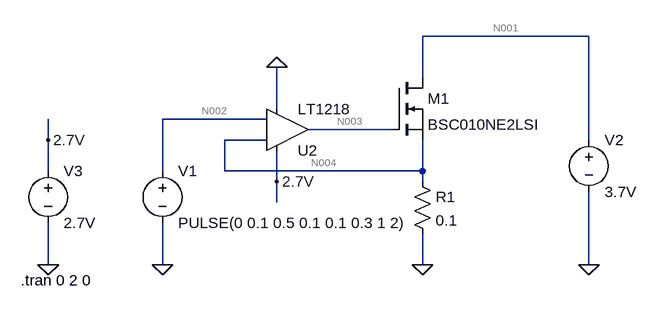
[diagram p0: schematic simulation-2.asc]
simulation-2.asc, the LTspice schematic file:
Version 4
SHEET 1 880 680
WIRE 656 0 400 0
WIRE 400 64 400 0
WIRE 176 112 176 48
WIRE 160 128 0 128
WIRE 352 144 224 144
WIRE -176 160 -176 128
WIRE 160 160 96 160
WIRE 656 160 656 0
WIRE -176 208 -176 160
WIRE 0 208 0 128
WIRE 96 208 96 160
WIRE 400 208 400 160
WIRE 400 208 96 208
WIRE 176 224 176 176
WIRE 400 224 400 208
WIRE 176 256 176 224
WIRE -176 352 -176 288
WIRE 0 352 0 288
WIRE 400 352 400 304
WIRE 656 352 656 240
FLAG 400 352 0
FLAG 0 352 0
FLAG 656 352 0
FLAG -176 352 0
FLAG -176 160 2.7V
FLAG 176 48 0
FLAG 176 224 2.7V
SYMBOL voltage 0 192 R0
WINDOW 123 0 0 Left 0
WINDOW 39 0 0 Left 0
SYMATTR InstName V1
SYMATTR Value PULSE(0 0.1 0.5 0.1 0.1 0.3 1 2)
SYMBOL res 384 208 R0
SYMATTR InstName R1
SYMATTR Value 0.1
SYMBOL nmos 352 64 R0
SYMATTR InstName M1
SYMATTR Value BSC010NE2LSI
SYMBOL voltage 656 144 R0
WINDOW 123 0 0 Left 0
WINDOW 39 0 0 Left 0
SYMATTR InstName V2
SYMATTR Value 3.7V
SYMBOL voltage -176 192 R0
WINDOW 123 0 0 Left 0
WINDOW 39 0 0 Left 0
SYMATTR InstName V3
SYMATTR Value 2.7V
SYMBOL Opamps\\LT1218 192 144 M180
SYMATTR InstName U2
TEXT -218 376 Left 2 !.tran 0 2 0

The netlist it stands for:
* simulation-2.asc
V1 N002 0 PULSE(0 0.1 0.5 0.1 0.1 0.3 1 2)
R1 N004 0 0.1
M1 N001 N003 N004 N004 BSC010NE2LSI
V2 N001 0 3.7V
V3 2.7V 0 2.7V
XU2 N002 N004 2.7V 0 N003 NC_01 LT1218
.model NMOS NMOS
.model PMOS PMOS
.lib standard.mos
.tran 0 2 0
.lib LTC.lib
.backanno
.end

* Results of the author's LTspice run, read from the files saved beside the schematic
* Operating Point, zero values left out:
*   V(n004) = 7.53 nV
*   V(n001) = 3.7 V
*   V(n003) = 1.331 V
*   V(2.7v) = 2.7 V
*   Id(M1) = 63.17 nA
*   Is(M1) = -63.17 nA
*   I(R1) = 75.3 nA
*   I(V3) = -305.9 µA
*   I(V2) = -63.17 nA
*   I(V1) = 12.12 nA
*   Ix(u2:1) = -12.12 nA
*   Ix(u2:2) = -12.12 nA
*   Ix(u2:3) = 305.9 µA
*   Ix(u2:4) = -305.9 µA
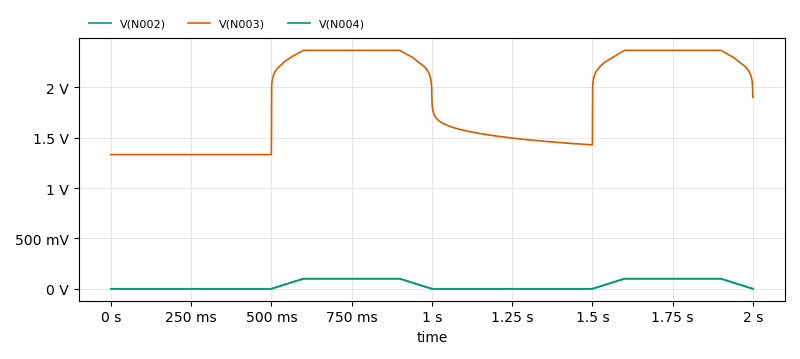
[diagram p1: Transient Analysis of simulation-2.asc, plotted from the saved traces]
* Transient Analysis, 1 run:
*   V(N002): min 0 V, max 100 mV, average 40 mV, rms 60.89 mV, last 0 V
*   V(N003): min 1.331 V, max 2.365 V, average 1.872 V, rms 1.927 V, last 1.9 V
*   V(N004): min 0 V, max 100 mV, average 40 mV, rms 60.89 mV, last 102.8 µV